# EAGLE design hackspace-power-controller (EAGLE 5.12)
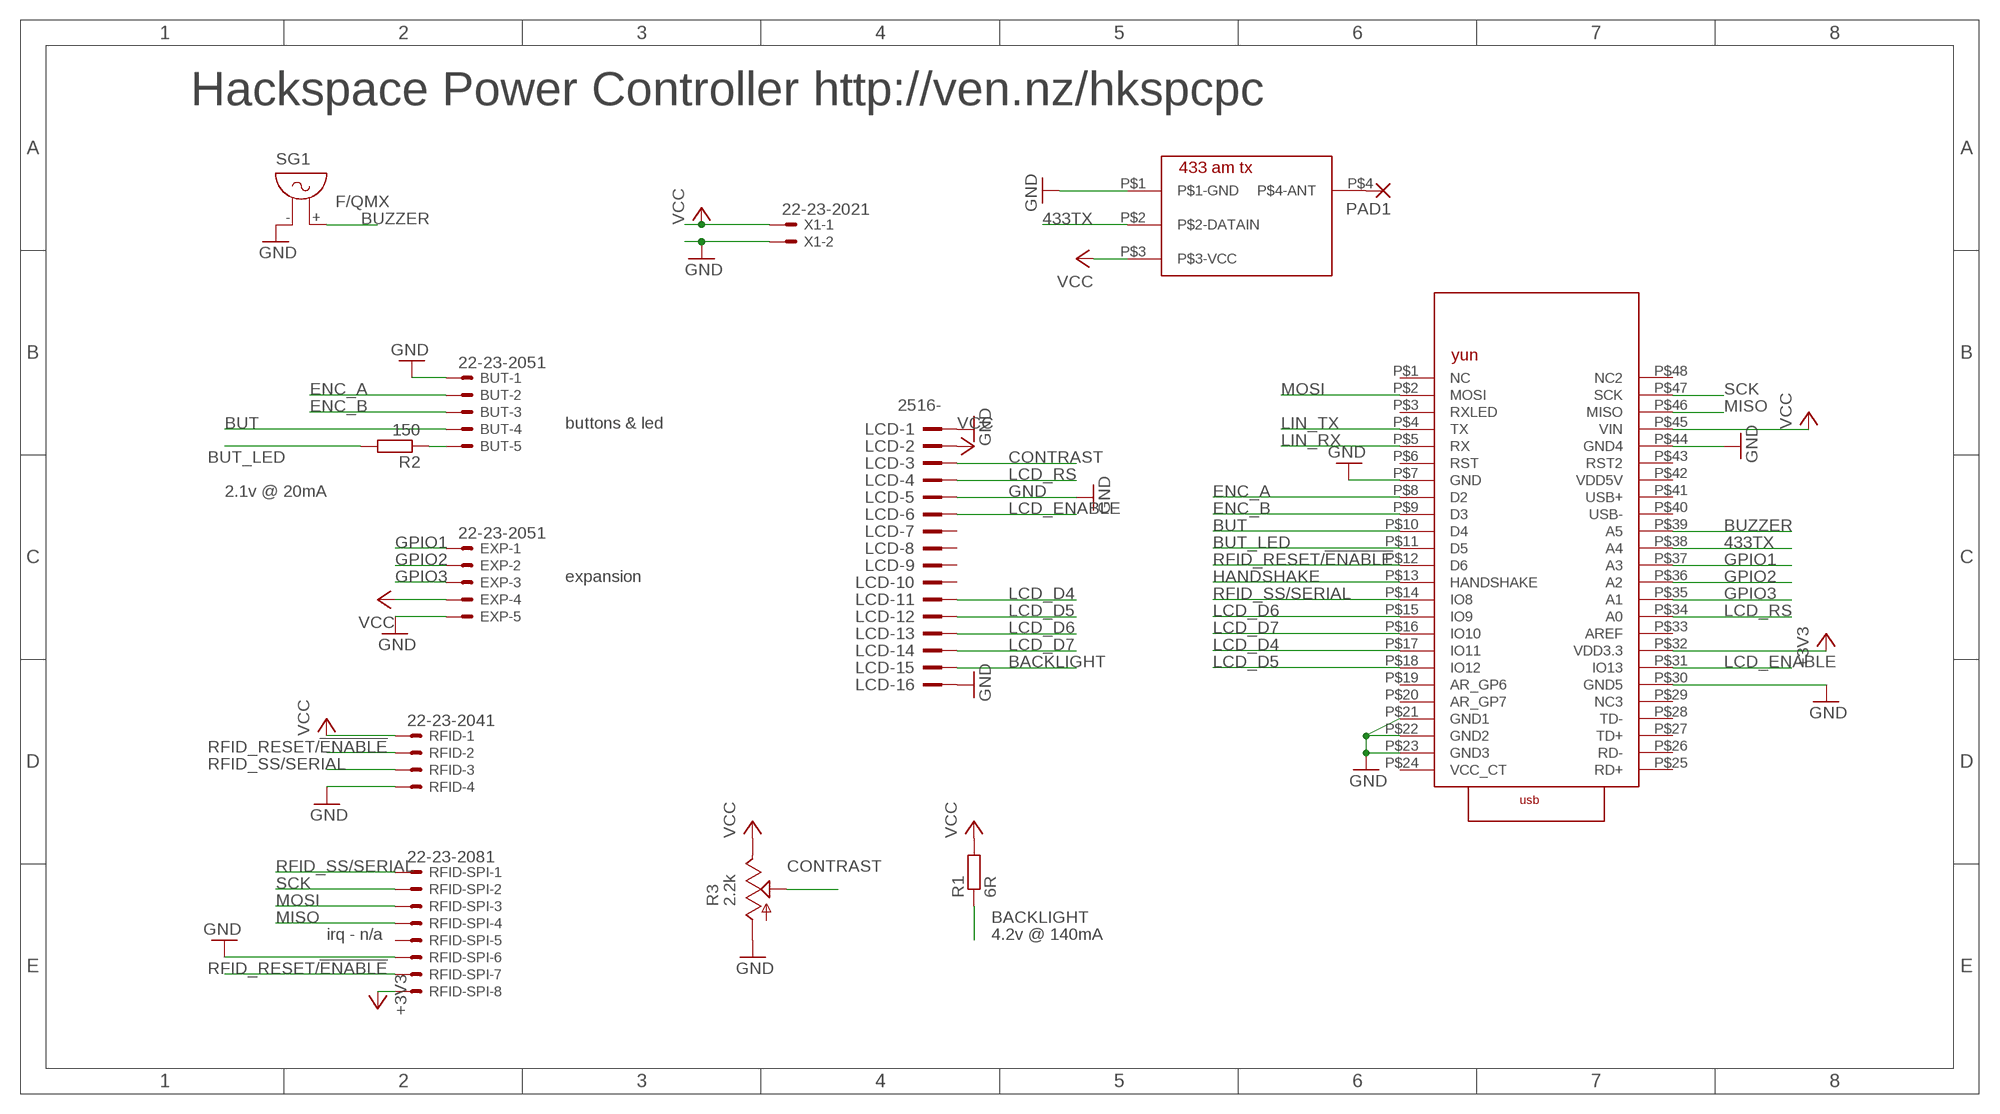
[diagram p0: schematic, sheet 1]

## Parts
BUT  22-23-2051  [22-23-2051]
EXP  22-23-2051  [22-23-2051]
LCD  2516-  [PAK100/2500-16]
PAD1  2,54/0,9  [2,54/0,9]
R1  6R  R-EU_0204/7  [0204/7]
R2  150  R-EU_0204/7  [0204/7]
R3  2.2k  TRIM_US-CA6V  [CA6V]
RFID  22-23-2041  [22-23-2041]
RFID-SPI  22-23-2081  [22-23-2081]
SG1  F/QMX  [F/QMX]
U$1  433TX  [433TX]
X1  22-23-2021  [22-23-2021]
YUN  YUN  [YUN]

## Nets
433TX: U$1.P$2(P$2-DATAIN) YUN.P$38(A4)
+3V3: RFID-SPI.8 YUN.P$32(VDD3.3)
BACKLIGHT: LCD.15 R1.1
BUT: BUT.4 YUN.P$10(D4)
BUT_LED: R2.2 YUN.P$11(D5)
BUZZER: SG1.+ YUN.P$39(A5)
CONTRAST: LCD.3 R3.S
ENC_A: BUT.2 YUN.P$8(D2)
ENC_B: BUT.3 YUN.P$9(D3)
GND [power]: BUT.1 EXP.5 LCD.1 LCD.5 LCD.16 R3.A RFID-SPI.6 RFID.4 SG1.- U$1.P$1(P$1-GND) X1.2 YUN.P$7(GND) YUN.P$21(GND1) YUN.P$22(GND2) YUN.P$23(GND3) YUN.P$30(GND5) YUN.P$44(GND4)
GPIO1: EXP.1 YUN.P$37(A3)
GPIO2: EXP.2 YUN.P$36(A2)
GPIO3: EXP.3 YUN.P$35(A1)
HANDSHAKE: YUN.P$13(HANDSHAKE)
LCD_D4: LCD.11 YUN.P$17(IO11)
LCD_D5: LCD.12 YUN.P$18(IO12)
LCD_D6: LCD.13 YUN.P$15(IO9)
LCD_D7: LCD.14 YUN.P$16(IO10)
LCD_ENABLE: LCD.6 YUN.P$31(IO13)
LCD_RS: LCD.4 YUN.P$34(A0)
LIN_RX: YUN.P$5(RX)
LIN_TX: YUN.P$4(TX)
MISO: RFID-SPI.4 YUN.P$46(MISO)
MOSI: RFID-SPI.3 YUN.P$2(MOSI)
N$1: PAD1.1(P) U$1.P$4(P$4-ANT)
N$2: BUT.5 R2.1
RFID_RESET/!ENABLE: RFID-SPI.7 RFID.2 YUN.P$12(D6)
RFID_SS/SERIAL: RFID-SPI.1 RFID.3 YUN.P$14(IO8)
SCK: RFID-SPI.2 YUN.P$47(SCK)
VCC [power]: EXP.4 LCD.2 R1.2 R3.E RFID.1 U$1.P$3(P$3-VCC) X1.1 YUN.P$45(VIN)
Unconnected: LCD.7 LCD.8 LCD.9 LCD.10 RFID-SPI.5 YUN.P$1(NC) YUN.P$3(RXLED) YUN.P$6(RST) YUN.P$19(AR_GP6) YUN.P$20(AR_GP7) YUN.P$24(VCC_CT) YUN.P$25(RD+) YUN.P$26(RD-) YUN.P$27(TD+) YUN.P$28(TD-) YUN.P$29(NC3) YUN.P$33(AREF) YUN.P$40(USB-) YUN.P$41(USB+) YUN.P$42(VDD5V) YUN.P$43(RST2) YUN.P$48(NC2)

## Notes on the sheet
- Hackspace Power Controller http://ven.nz/hkspcpc
- buttons & led
- 2.1v @ 20mA
- expansion
- irq - n/a | 4.2v @ 140mA

## Library data of the parts
BUT EXP = con-molex:22-23-2051: .100" (2.54mm) Center Header - 5 Pin; MF: MOLEX; MPN: 22-23-2051; OC_FARNELL: 1462952; OC_NEWARK: 38C9178
LCD = con-3m:2516-: 3M (TM) Pak 100 4-Wall Header Source: 3M; OC_FARNELL: unknown; OC_NEWARK: unknown
PAD1 = wirepad:2,54/0,9: THROUGH-HOLE PAD
R1 R2 = matt rcl:R-EU_: RESISTOR, European symbol
R3 = pot:TRIM_US-: POTENTIOMETER
RFID = con-molex:22-23-2041: .100" (2.54mm) Center Header - 4 Pin; MF: MOLEX; MPN: 22-23-2041; OC_FARNELL: 1462920; OC_NEWARK: 38C0355
RFID-SPI = con-molex:22-23-2081: .100" (2.54mm) Center Header - 8 Pin; MF: MOLEX; MPN: 22-23-2081; OC_FARNELL: 1756826; OC_NEWARK: 01C7592
SG1 = matt:F/QMX: BUZZER Source: Buerklin; OC_FARNELL: unknown; OC_NEWARK: unknown
U$1 = matt:433TX
X1 = con-molex:22-23-2021: .100" (2.54mm) Center Header - 2 Pin; MF: MOLEX; MPN: 22-23-2021; OC_FARNELL: 1462926; OC_NEWARK: 25C3832
YUN = matt:YUN

## Net classes
1 power: width 0.508 mm

## Board
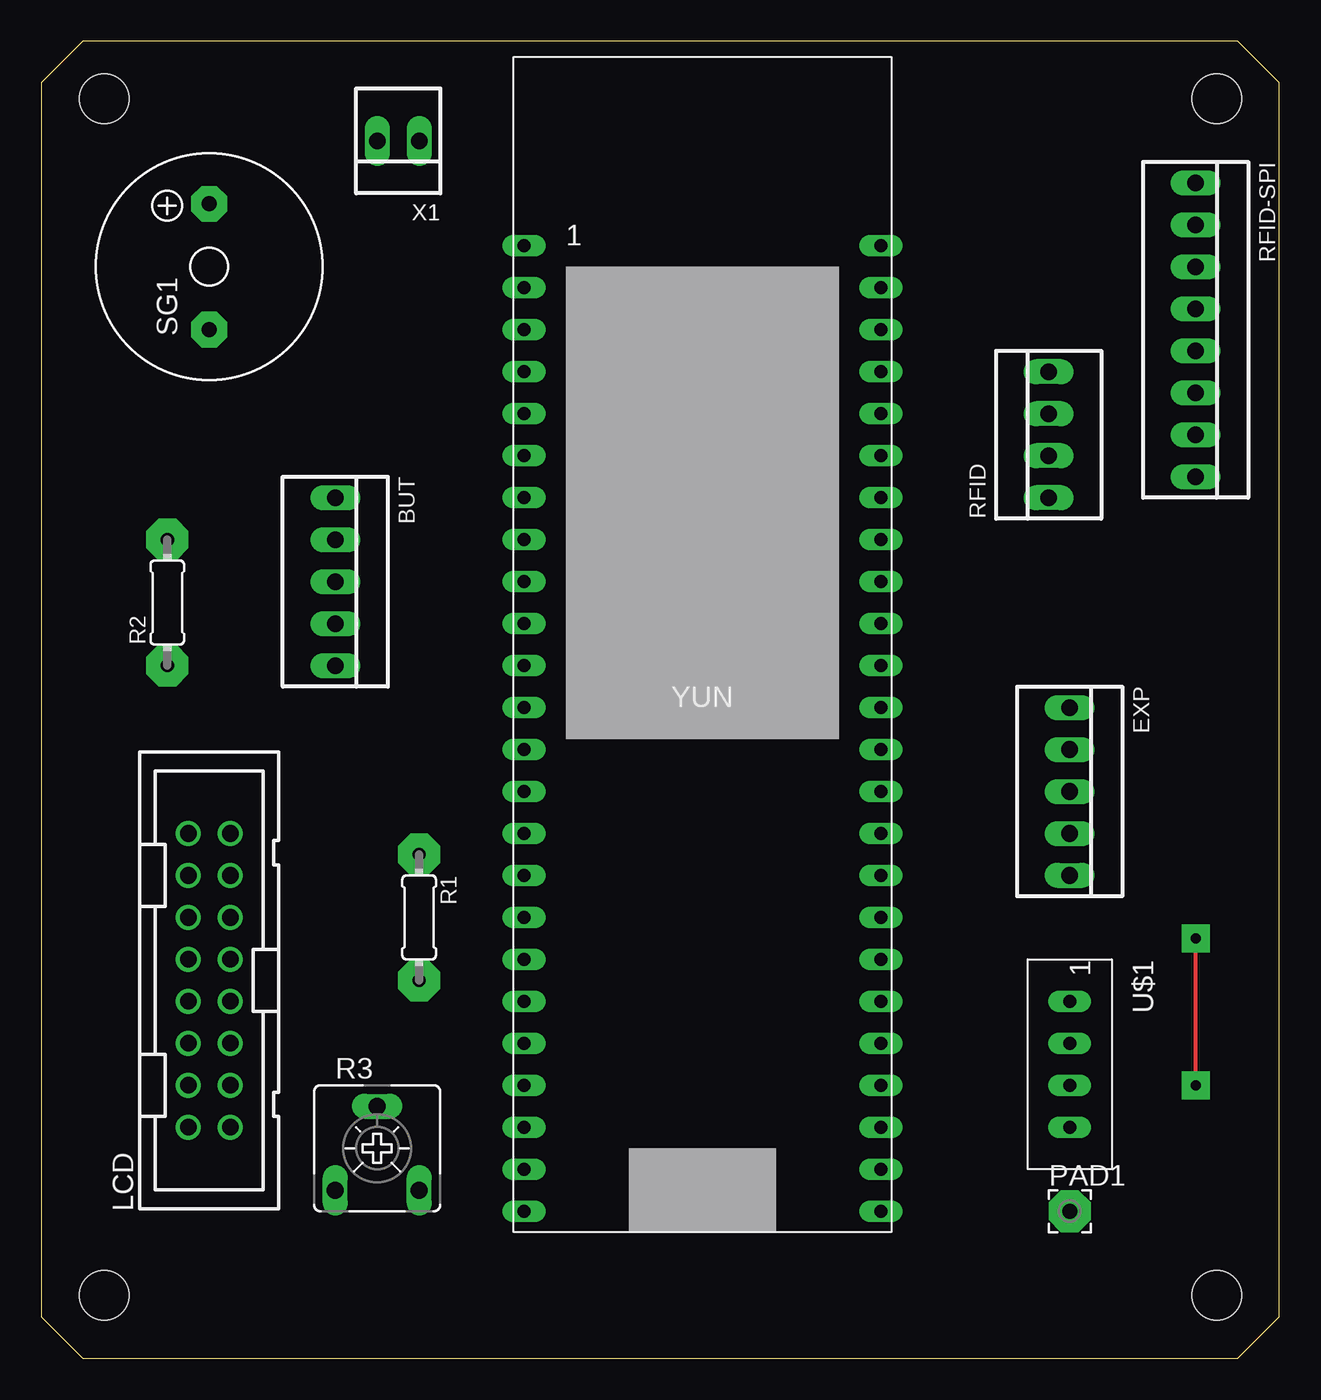
[diagram p1: board, top side]
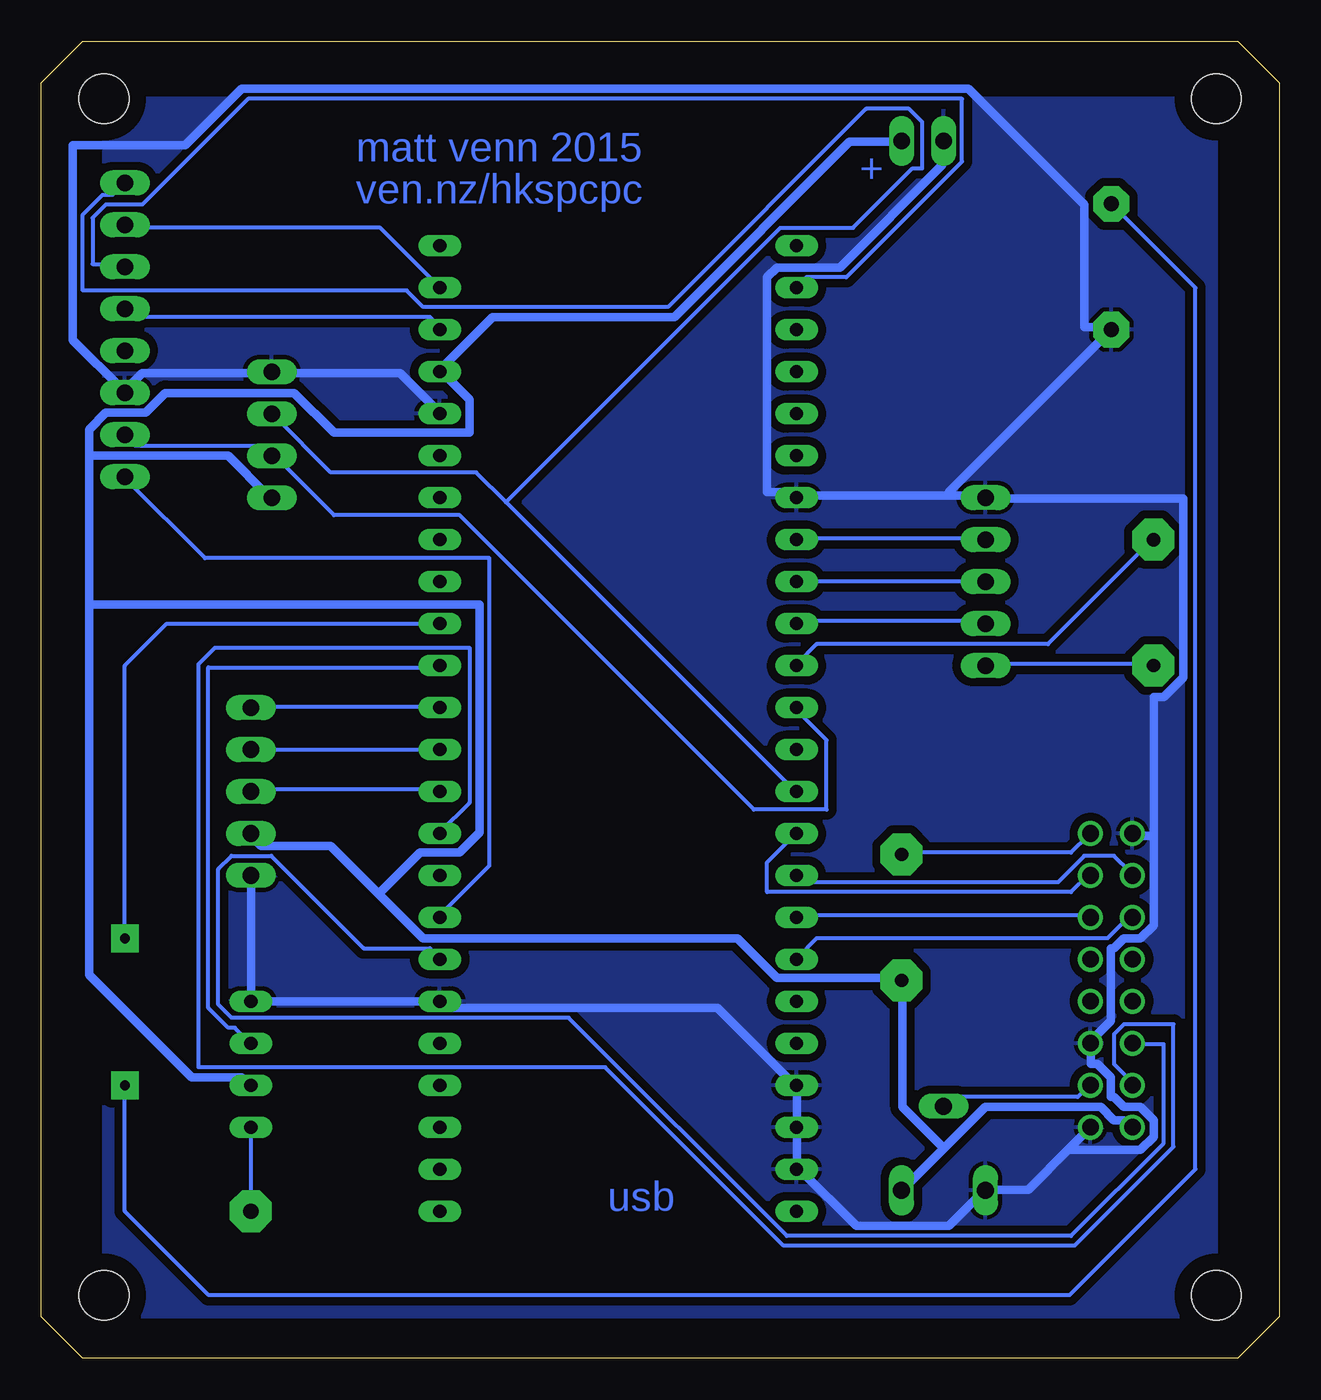
[diagram p2: board, bottom side, seen from below]

Size 74.91 x 79.68 mm. Coordinates in mm from the lower left corner, seen from the top.
Outline: 2.5,79.68 0,77.18 0,2.5 2.5,0 72.41,0 74.91,2.5 74.91,77.18 72.41,79.68 2.5,79.68
Copper layers (1*16): Top 0.035mm / dielectric 1.5mm / Bottom 0.035mm
Design rules "default": minimum track width 10mil, minimum drill 24mil, track to track 8mil, track to pad 8mil, pad to pad 8mil, via to via 8mil, smd to smd 8mil, copper to edge 40mil, drill to drill 8mil, minimum pad ring 10mil, minimum via ring 8mil, stop-mask expansion 4mil, vias tented up to drill 0mil, thermal gap 10mil
Holes 3 mm at 3.81,76.2 71.12,76.2 3.81,3.81 71.12,3.81

### Footprints (pad centres in the part's own frame; a part is rotated, then mirrored left to right if it is on the bottom)
22-23-2051 = drill 1 long: 1 -5.08,0; 2 -2.54,0; 3 0,0; 4 2.54,0; 5 5.08,0
PAK100/2500-16 = drill 1 pad 1.422 round: 1 -8.89,-1.27; 2 -8.89,1.27; 3 -6.35,-1.27; 4 -6.35,1.27; 5 -3.81,-1.27; 6 -3.81,1.27; 7 -1.27,-1.27; 8 -1.27,1.27; 9 1.27,-1.27; 10 1.27,1.27; 11 3.81,-1.27; 12 3.81,1.27; 13 6.35,-1.27; 14 6.35,1.27; 15 8.89,-1.27; 16 8.89,1.27
2,54/0,9 = drill 0.914 pad 2.54 octagon: 1 0,0
0204/7 = drill 0.813 pad 2.54 octagon: 1 -3.81,0; 2 3.81,0
CA6V = drill 1.016 long: A -2.54,-2.54; E 2.54,-2.54; S 0,2.54
22-23-2041 = drill 1 long: 1 -3.81,0; 2 -1.27,0; 3 1.27,0; 4 3.81,0
22-23-2081 = drill 1 long: 1 -8.89,0; 2 -6.35,0; 3 -3.81,0; 4 -1.27,0; 5 1.27,0; 6 3.81,0; 7 6.35,0; 8 8.89,0
F/QMX = drill 0.914 pad 2.159 octagon: + 3.81,0; - -3.81,0
433TX = drill 0.8 long: P$1 -3.81,0; P$2 -1.27,0; P$3 1.27,0; P$4 3.81,0
22-23-2021 = drill 1 long: 1 -1.27,0; 2 1.27,0
YUN = drill 0.8 long: P$1 -11.43,29.21; P$2 -11.43,26.67; P$3 -11.43,24.13; P$4 -11.43,21.59; P$5 -11.43,19.05; P$6 -11.43,16.51; P$7 -11.43,13.97; P$8 -11.43,11.43; P$9 -11.43,8.89; P$10 -11.43,6.35; P$11 -11.43,3.81; P$12 -11.43,1.27; P$13 -11.43,-1.27; P$14 -11.43,-3.81; P$15 -11.43,-6.35; P$16 -11.43,-8.89; P$17 -11.43,-11.43; P$18 -11.43,-13.97; P$19 -11.43,-16.51; P$20 -11.43,-19.05; P$21 -11.43,-21.59; P$22 -11.43,-24.13; P$23 -11.43,-26.67; P$24 -11.43,-29.21; P$25 10.16,-29.21; P$26 10.16,-26.67; P$27 10.16,-24.13; P$28 10.16,-21.59; P$29 10.16,-19.05; P$30 10.16,-16.51; P$31 10.16,-13.97; P$32 10.16,-11.43; P$33 10.16,-8.89; P$34 10.16,-6.35; P$35 10.16,-3.81; P$36 10.16,-1.27; P$37 10.16,1.27; P$38 10.16,3.81; P$39 10.16,6.35; P$40 10.16,8.89; P$41 10.16,11.43; P$42 10.16,13.97; P$43 10.16,16.51; P$44 10.16,19.05; P$45 10.16,21.59; P$46 10.16,24.13; P$47 10.16,26.67; P$48 10.16,29.21

### Placement (x,y rotation side)
BUT  17.78,46.99 270 top
EXP  62.23,34.29 270 top
LCD  10.16,22.86 90 top
PAD1  62.23,8.89 0 top
R1  22.86,26.67 270 top
R2  7.62,45.72 90 top
R3  20.32,12.7 0 top
RFID  60.96,55.88 90 top
RFID-SPI  69.85,62.23 270 top
SG1  10.16,66.04 90 top
U$1  62.23,17.78 270 top
X1  21.59,73.66 180 top
YUN  40.64,38.1 0 top

### Tracks (layer width: path | path; a pad name or v marks a point on that pad's centre or on a via)
433TX
  Bottom 0.254: U$1.P$2 62.4,19.2 63.2,20 63.6,20 64.8,21.2 64.8,41.8 50.8,41.8 YUN.P$38
+3V3
  Bottom 0.254: YUN.P$32 50.8,26.8 47.8,29.8 47.8,48.4 65,48.4 69.8,53.2 RFID-SPI.8
BACKLIGHT
  Bottom 0.254: LCD.15 11.6,31.6 12.6,30.6 22.8,30.6 R1.1
BUT
  Bottom 0.254: YUN.P$10 29.2,44.6 17.8,44.6 BUT.4
BUT_LED
  Bottom 0.254: YUN.P$11 29.2,42 28,43.2 14,43.2 7.8,49.4 R2.2
BUZZER  (via drill 0.6 pad 1.68)
  Top 0.254: v69.85,16.51 v69.85,25.4
  Bottom 0.254: YUN.P$39 67.31,44.45 69.85,41.91 v69.85,25.4 | v69.85,16.51 69.85,8.89 64.77,3.81 12.7,3.81 5.08,11.43 5.08,64.77 SG1.+
CONTRAST
  Bottom 0.254: LCD.3 11.6,16.4 12.2,15.8 19.8,15.8 20.2,15.4 R3.S
ENC_A
  Bottom 0.254: YUN.P$8 29.2,49.6 17.8,49.6 BUT.2
ENC_B
  Bottom 0.254: YUN.P$9 17.8,47 BUT.3
GND
  Bottom 0.508: EXP.5 62.2,29.2 62.2,21.8 U$1.P$1 62.2,21.6 YUN.P$30 50.6,21.6 50.2,21.2 34,21.2 29.4,16.6 YUN.P$21 29.2,16.4 29.2,14.2 YUN.P$22 29.2,13.8 29.2,11.6 YUN.P$23 29,11.4 25.6,8 20,8 18,10 R3.A 17.6,10.2 15.2,10.2 12.7,12.7 | 7.6,31.6 7.6,26.2 8.4,25.4 9.4,25.4 10,24.8 10.2,24.8 10.2,20.4 11.4,19.2 LCD.5 11.4,18.8 11.4,17.8 11,17.8 10.2,17 10.2,15.8 10,15.8 9.4,15.2 8.4,15.2 7.6,14.4 7.6,13.4 8.4,12.6 12.6,12.6 12.7,12.7 | 7.6,31.6 8.8,31.6 LCD.16 | 12.7,12.7 LCD.1 | YUN.P$44 50.8,57.2 53.2,59.6 60.8,59.6 RFID.4 61,59.6 68.8,59.6 69.8,58.6 RFID-SPI.6 70,58.6 73,61.6 73,73.4 66.2,73.4 62.8,76.8 18.8,76.8 11.8,69.8 11.8,62.4 10.2,62.4 SG1.- 10.2,62.2 20,52.4 20,52.2 | 20,52.2 17.8,52.2 BUT.1 17.6,52 5.8,52 5.8,41.2 7,40 7.6,40 7.6,31.6 | 20,52.2 29.2,52.2 YUN.P$7 29.2,52.4 31,52.4 31,65.4 30.4,66 26.6,66 20.4,72.2 20.4,73.6 X1.2
  pour Bottom (isolate 0.5): 3.81,3.81 3.81,76.2 71.12,76.2 71.12,2.54 5.08,2.54
GPIO1
  Bottom 0.254: YUN.P$37 50.8,39.4 62.2,39.4 EXP.1
GPIO2
  Bottom 0.254: YUN.P$36 50.8,36.8 62.2,36.8 EXP.2
GPIO3
  Bottom 0.254: YUN.P$35 50.8,34.4 62.2,34.4 EXP.3
LCD_D4
  Bottom 0.254: YUN.P$17 29.2,26.8 11.6,26.8 LCD.11
LCD_D5
  Bottom 0.254: YUN.P$18 29.2,24.2 28,25.4 10.4,25.4 9.2,26.6 9,26.6 LCD.12
LCD_D6
  Bottom 0.254: YUN.P$15 29.4,31.6 31,30 31,28.2 12.6,28.2 11.6,29.2 LCD.13
LCD_D7
  Bottom 0.254: YUN.P$16 28.8,28.8 13.4,28.8 11.8,30.4 10,30.4 9,29.4 LCD.14
LCD_ENABLE
  Bottom 0.254: YUN.P$31 50.8,24.2 51.4,24.8 55.4,24.8 61,30.4 63.4,30.4 64.2,29.6 64.2,21.4 63.4,20.6 43,20.6 29.8,7.4 12.6,7.4 7,13 7,19 8.8,19 LCD.6
LCD_RS
  Bottom 0.254: YUN.P$34 50.8,31.8 49,33.6 49,43 64.4,43 65.4,42 65.4,17.6 40.8,17.6 30,6.8 12.4,6.8 6.4,12.8 6.4,20.2 9.4,20.2 10,19.6 10,17.8 8.8,16.6 LCD.4
MISO
  Bottom 0.254: YUN.P$46 50.8,62.4 51.4,63 69.4,63 69.8,63.4 RFID-SPI.4
MOSI
  Bottom 0.254: YUN.P$2 29.2,64.8 28.6,65.4 26.2,65.4 19.2,72.4 19.2,76.2 62.4,76.2 68.8,69.8 71,69.8 71.8,69 71.8,66.2 70,66.2 RFID-SPI.3
N$1
  Bottom 0.254: U$1.P$4 62.2,13.8 62.2,9 PAD1.1
N$2
  Bottom 0.254: BUT.5 17.6,42 7.8,42 R2.1
RFID_RESET/!ENABLE
  Bottom 0.254: YUN.P$12 29.2,39.2 27.4,37.4 27.4,33.2 31.8,33.2 49.6,51 57.2,51 60.8,54.6 RFID.2 61,54.8 61.4,55.2 69.2,55.2 69.8,55.8 RFID-SPI.7
RFID_SS/SERIAL
  Bottom 0.254: 46.8,51.8 48.6,53.6 57.4,53.6 60.8,57 RFID.3 | 46.8,51.8 29.4,34.4 YUN.P$14 | 46.8,51.8 30.2,68.4 25.8,68.4 22.2,72 21.6,72 21.6,74.8 22.4,75.6 25,75.6 37,63.6 51.8,63.6 52.8,64.6 72.4,64.6 72.4,69.2 71.2,70.4 70.6,70.4 70,71 RFID-SPI.1
SCK
  Bottom 0.254: YUN.P$47 50.8,64.8 54.4,68.4 69.8,68.4 RFID-SPI.2
VCC
  Bottom 0.508: 20.3,12.7 22.8,10.2 R3.E | 20.3,12.7 17.8,15.2 10.8,15.2 10,14.4 9.4,14.4 9,14 LCD.2 | 54.5,28.1 51.8,25.4 32.8,25.4 30.4,23 23,23 R1.2 22.8,22.8 22.8,15.2 20.3,12.7 | 54.5,28.1 57.4,31 61.6,31 62.2,31.6 EXP.4 | X1.1 23,73.6 26,73.6 36.6,63 47.6,63 50.8,59.8 YUN.P$45 50.6,59.6 49,58 49,56 57.2,56 59.6,58.4 67.4,58.4 68.6,57.2 71,57.2 72,56.2 72,54.6 | 72,45.6 72,54.6 | 72,45.6 72,23.2 65.8,17 62.8,17 62.4,16.6 U$1.P$3 | 72,54.6 63.6,54.6 61.2,52.2 61,52.2 RFID.1 | 54.5,28.1 52,30.6 49.6,30.6 48.4,31.8 48.4,45.6 72,45.6

### Text on the board
Bottom: matt venn 2015 | + | ven.nz/hkspcpc | usb